# Altium schematic sheet source.SchDoc
size A4
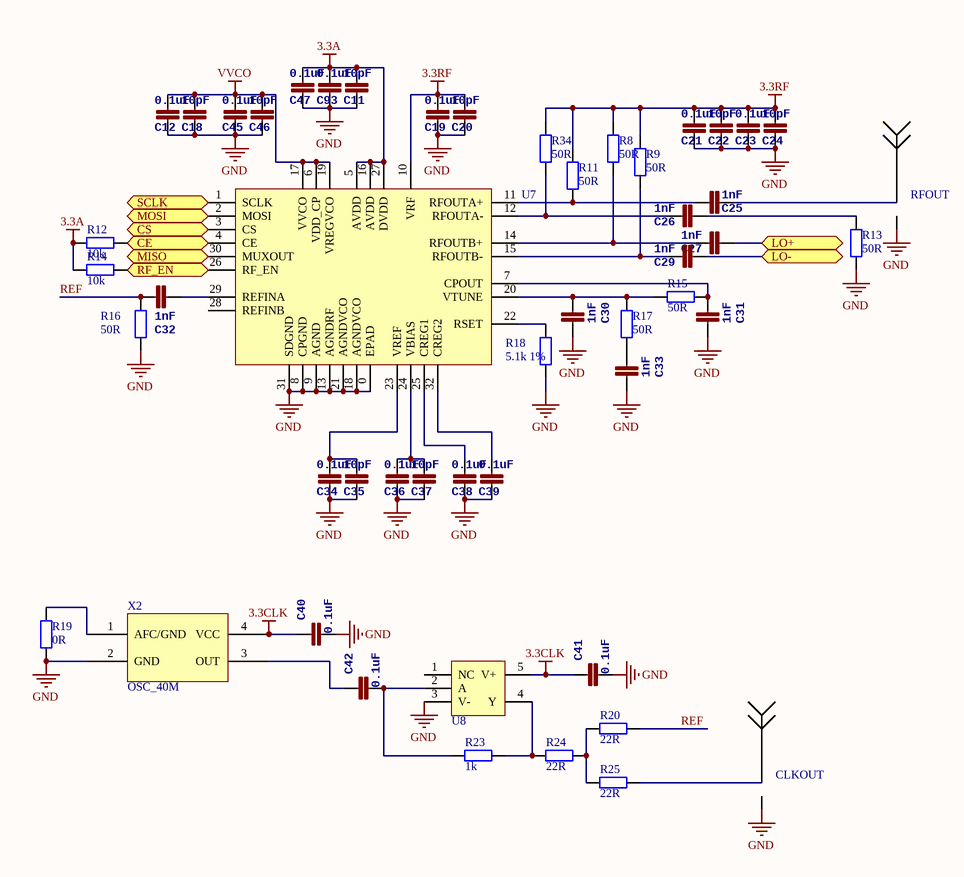
[diagram p0: source.SchDoc]

## Parts
C11  10pF  [0402]
C12  0.1uF  [0402]
C18  10pF  [0402]
C19  0.1uF  [0402]
C20  10pF  [0402]
C21  0.1uF  [0402]
C22  10pF  [0402]
C23  0.1uF  [0402]
C24  10pF  [0402]
C25  1nF  [0402]
C26  1nF  [0402]
C27  1nF  [0402]
C29  1nF  [0402]
C30  1nF  [0402]
C31  1nF  [0402]
C32  1nF  [0402]
C33  1nF  [0402]
C34  0.1uF  [0402]
C35  10pF  [0402]
C36  0.1uF  [0402]
C37  10pF  [0402]
C38  0.1uF  [0402]
C39  0.1uF  [0402]
C40  0.1uF  [0402]
C41  0.1uF  [0402]
C42  0.1uF  [0402]
C45  0.1uF  [0402]
C46  10pF  [0402]
C47  0.1uF  [0402]
C93  0.1uF  [0402]
CLKOUT  Antenna  [SMA-2B]  (value not drawn)
R8  50R  [0402]
R9  50R  [0402]
R11  50R  [0402]
R12  10k  [0402]
R13  50R  [0402]
R14  10k  [0402]
R15  50R  [0402]
R16  50R  [0402]
R17  50R  [0402]
R18  5.1k 1%  [0402]
R19  0R  [0402]
R20  22R  [0402]
R23  1k  [0402]
R24  22R  [0402]
R25  22R  [0402]
R34  50R  [0402]
RFOUT  Antenna  [SMA-2B]  (value not drawn)
U7  ADF4355  [ADF4351]  (value not drawn)
U8  74-1G04  [SOT23-5]  (value not drawn)
X2  OSC_40M  [TXC_7Q]

## Ports
CE, CS, LO+, LO-, MISO, MOSI, RF_EN, SCLK

## Nets
3.3A: C11.1 C47.1 C93.1 R12.2 R14.2 U7.5(AVDD) U7.16(AVDD) U7.27(DVDD)
3.3CLK: C40.1 C41.1 U8.5(V+) X2.4(VCC)
3.3RF: C19.1 C20.1 C21.1 C22.1 C23.1 C24.1 R8.2 R9.2 R11.2 R34.2 U7.10(VRF)
GND: C11.2 C12.2 C18.2 C19.2 C20.2 C21.2 C22.2 C23.2 C24.2 C30.2 C31.2 C33.2 C34.2 C35.2 C36.2 C37.2 C38.2 C39.2 C40.2 C41.2 C45.2 C46.2 C47.2 C93.2 CLKOUT.GND(G) R13.2 R16.1 R18.1 R19.2 RFOUT.GND(G) U7.0(EPAD) U7.8(CPGND) U7.9(AGND) U7.13(AGNDRF) U7.18(AGNDVCO) U7.21(AGNDVCO) U7.31(SDGND) U8.3(V-) X2.2(GND)
VVCO: C12.1 C18.1 C45.1 C46.1 U7.6(VDD_CP) U7.17(VVCO) U7.19(VREGVCO)
CE: R12.1 U7.4(CE) ; port CE
CS: U7.3(CS) ; port CS
LO+: C27.1 ; port LO+
LO-: C29.1 ; port LO-
MISO: U7.30(MUXOUT) ; port MISO
MOSI: U7.2(MOSI) ; port MOSI
REF: C32.2 R16.2 R20.2
RF_EN: R14.1 U7.26(RF_EN) ; port RF_EN
SCLK: U7.1(SCLK) ; port SCLK
NetC25_1: C25.1 R11.1 U7.11(RFOUTA+)
NetC25_2: C25.2 RFOUT.1
NetC26_1: C26.1 R13.1
NetC26_2: C26.2 R34.1 U7.12(RFOUTA-)
NetC27_2: C27.2 R8.1 U7.14(RFOUTB+)
NetC29_2: C29.2 R9.1 U7.15(RFOUTB-)
NetC30_1: C30.1 R15.1 R17.1 U7.20(VTUNE)
NetC31_1: C31.1 R15.2 U7.7(CPOUT)
NetC32_1: C32.1 U7.29(REFINA)
NetC33_1: C33.1 R17.2
NetC34_1: C34.1 C35.1 U7.23(VREF)
NetC36_1: C36.1 C37.1 U7.24(VBIAS)
NetC38_1: C38.1 U7.25(CREG1)
NetC39_1: C39.1 U7.32(CREG2)
NetC42_1: C42.1 X2.3(OUT)
NetC42_2: C42.2 R23.1 U8.2(A)
NetCLKOUT_1: CLKOUT.1 R25.2
NetR18_2: R18.2 U7.22(RSET)
NetR19_1: R19.1 X2.1(AFC/GND)
NetR20_1: R20.1 R24.2 R25.1
NetR23_2: R23.2 R24.1 U8.4(Y)

Not connected (* = marked no-connect by the designer): U7 28(REFINB); U8 1(NC)

## Library data of the parts
C11 C12 C18-C27 C29-C42 C45-C47 C93 = CAP0402-CAP: <b>Capacitor</b> / Standard 0603 ceramic capacitor, and 0.1" leaded capacitor.; PARTNO: CC0402ZRY5V7BB104
R8 R9 R11-R20 R23-R25 R34 = Res2: Resistor; Value: 0Ohm; Published: 8-Jun-2000; LatestRevisionDate: 17-Jul-2002; LatestRevisionNote: Re-released for DXP Platform.; PackageReference: AXIAL-0.4; Publisher: Altium Limited; PackageDescription: Axial Device, Thru-Hole; 2 Leads; 0.4 in Pin Spacing